# Altium schematic sheet LED Indicator.SchDoc
size A
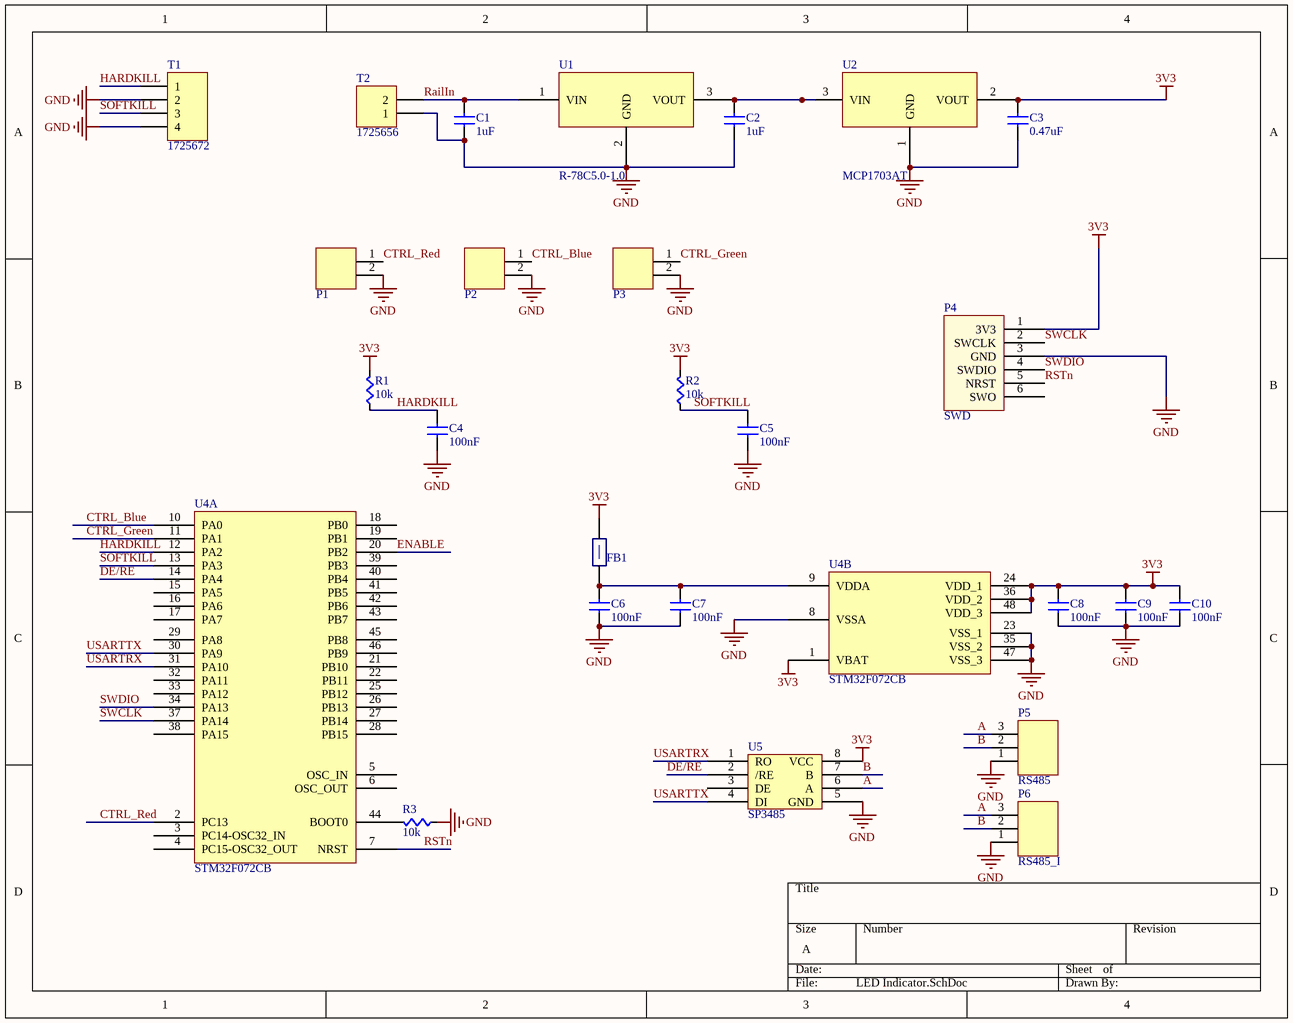
[diagram p0: LED Indicator.SchDoc]

## Parts
C1  value 1uF  [CAPC0603]  (hidden comment: Cap)
C2  value 1uF  [CAPC0603]  (hidden comment: Cap)
C3  value 0.47uF  [CAPC0603]  (hidden comment: Cap)
C4  value 100nF  [CAPC0603]  (hidden comment: Cap)
C5  value 100nF  [CAPC0603]  (hidden comment: Cap)
C6  value 100nF  [CAPC0603]  (hidden comment: Cap)
C7  value 100nF  [CAPC0603]  (hidden comment: Cap)
C8  value 100nF  [CAPC0603]  (hidden comment: Cap)
C9  value 100nF  [CAPC0603]  (hidden comment: Cap)
C10  value 100nF  [CAPC0603]  (hidden comment: Cap)
FB1  FBead  [RES0603]  (value not drawn)
P1  2-pin Horz Sherlock  [MOLEX-HDR-1X2-SHERLOCK-HORZ]  (value not drawn)
P2  2-pin Horz Sherlock  [MOLEX-HDR-1X2-SHERLOCK-HORZ]  (value not drawn)
P3  2-pin Horz Sherlock  [MOLEX-HDR-1X2-SHERLOCK-HORZ]  (value not drawn)
P4  SWD  [SWD_STM32]
P5  RS485  [MOLEX-HDR-1X3-SHERLOCK-RA]
P6  RS485_I  [MOLEX-HDR-1X3-SHERLOCK-RA]
R1  value 10k  [RES0603]  (hidden comment: Res)
R2  value 10k  [RES0603]  (hidden comment: Res)
R3  value 10k  [RES0603]  (hidden comment: Res)
T1  1725672  [1725672]
T2  1725656  [1725656]
U1  R-78C5.0-1.0  [R-78C5.0-1.0]
U2  MCP1703AT  [MCP1703AT-xx02EDB]
U4  STM32F072CB  [STM32F072CB]  (parts A,B of 2)
U5  SP3485  [SP3485]

## Nets
3V3: C3.1(A) C8.1(A) C9.1(A) C10.1(A) FB1.2(B) P4.1(3V3) R1.1(A) R2.1(A) U2.2(VOUT) U4.1(VBAT) U4.24(VDD_1) U4.36(VDD_2) U4.48(VDD_3) U5.8(VCC)
GND: C1.2(B) C2.2(B) C3.2(B) C4.2(B) C5.2(B) C6.2(B) C7.2(B) C8.2(B) C9.2(B) C10.2(B) P1.2 P2.2 P3.2 P4.3(GND) P5.1 P6.1 R3.2(B) T1.2 T1.4 T2.1 U1.2(GND) U2.1(GND) U4.8(VSSA) U4.23(VSS_1) U4.35(VSS_2) U4.47(VSS_3) U5.5(GND)
A: P5.3 P6.3 U5.6(A)
B: P5.2 P6.2 U5.7(B)
CTRL_Blue: P2.1 U4.10(PA0)
CTRL_Green: P3.1 U4.11(PA1)
CTRL_Red: P1.1 U4.2(PC13)
DE/RE: U4.14(PA4) U5.2(/RE)
ENABLE: U4.20(PB2)
HARDKILL: C4.1(A) R1.2(B) T1.1 U4.12(PA2)
RailIn: C1.1(A) T2.2 U1.1(VIN)
RSTn: P4.5(NRST) U4.7(NRST)
SOFTKILL: C5.1(A) R2.2(B) T1.3 U4.13(PA3)
SWCLK: P4.2(SWCLK) U4.37(PA14)
SWDIO: P4.4(SWDIO) U4.34(PA13)
USARTRX: U4.31(PA10) U5.1(RO)
USARTTX: U4.30(PA9) U5.4(DI)
NetC2_1: C2.1(A) U1.3(VOUT) U2.3(VIN)
NetC6_1: C6.1(A) C7.1(A) FB1.1(A) U4.9(VDDA)
NetR3_1: R3.1(A) U4.44(BOOT0)

Not connected (* = marked no-connect by the designer): P4 6(SWO); U4 3(PC14-OSC32_IN) 4(PC15-OSC32_OUT) 5(OSC_IN) 6(OSC_OUT) 15(PA5) 16(PA6) 17(PA7) 18(PB0) 19(PB1) 21(PB10) 22(PB11) 25(PB12) 26(PB13) 27(PB14) 28(PB15) 29(PA8) 32(PA11) 33(PA12) 38(PA15) 39(PB3) 40(PB4) 41(PB5) 42(PB6) 43(PB7) 45(PB8) 46(PB9); U5 3(DE)

## Library data of the parts
FB1 = FBead: Ferrite Bead; Supplier 1: Digi-Key; Supplier Part Number 1: 445-2988-1-ND
P1-P3 = MOLEX-HDR-1x2-SHERLOCK_RA: Header, Molex, 2mm Pitch Sherlock Header, Single Row, Horizontal, 2 Circuits, Length 3.3mm,  0353630260; Manufacturer: Molex Inc; Manufacturer Part Number: 0353630260; Supplier Part Number: WM18931-ND; Supplier: Digi-Key
P4 = SWD_STM32: SWD connector matching the pinout on STM Discovery Boards
P5 P6 = MOLEX-HDR-1x3-SHERLOCK_RA: Header, Molex, 2mm Pitch Sherlock Header, Single Row, Right Angle 3 Circuits, Length 3.3mm; Manufacturer Part Number: 35363-0360; Manufacturer: Molex Connector Corporation; Supplier Part Number 1: WM18932-ND; Supplier 1: Digi-Key
T1 = 1725672: CONN TERM BLOCK 2.54MM 4POS; Supplier 1: Digi-Key; Supplier Part Number 1: 277-1275-ND
T2 = 1725656: CONN TERM BLOCK 2.54MM 2POS; Supplier 1: Digi-Key; Supplier Part Number 1: 277-1273-ND
U1 = R-78C5.0-1.0: CONV DC/DC 1A 5V OUT SIP VERT; Supplier 1: Digi-Key; Supplier Part Number 1: 945-1395-5-ND
U2 = MCP1703AT: 250 mA, 16V, Low Quiescent Current LDO Regulator; Supplier 1: Digi-Key; Supplier Part Number 1: MCP1703AT-3302E/CBCT-ND
U4 = STM32F072CB: MCU 32BIT 128KB FLASH 48LQFP; Supplier 1: Digi-Key; Supplier Part Number 1: 497-14645-ND
U5 = SP3485: IC TXRX RS485 HALF DUPLEX 8NSOIC; Supplier 1: Digi-Key; Supplier Part Number 1: 1016-1817-1-ND
C1-C10 = Cap: Supplier 1: Digi-Key; Supplier Part Number 1: 1276-1000-1-ND
R1-R3 = Res: Supplier 1: Digi-Key; Supplier Part Number 1: RMCF0603JT10K0CT-ND